# Altium schematic sheet Sheet2.SchDoc
size A3
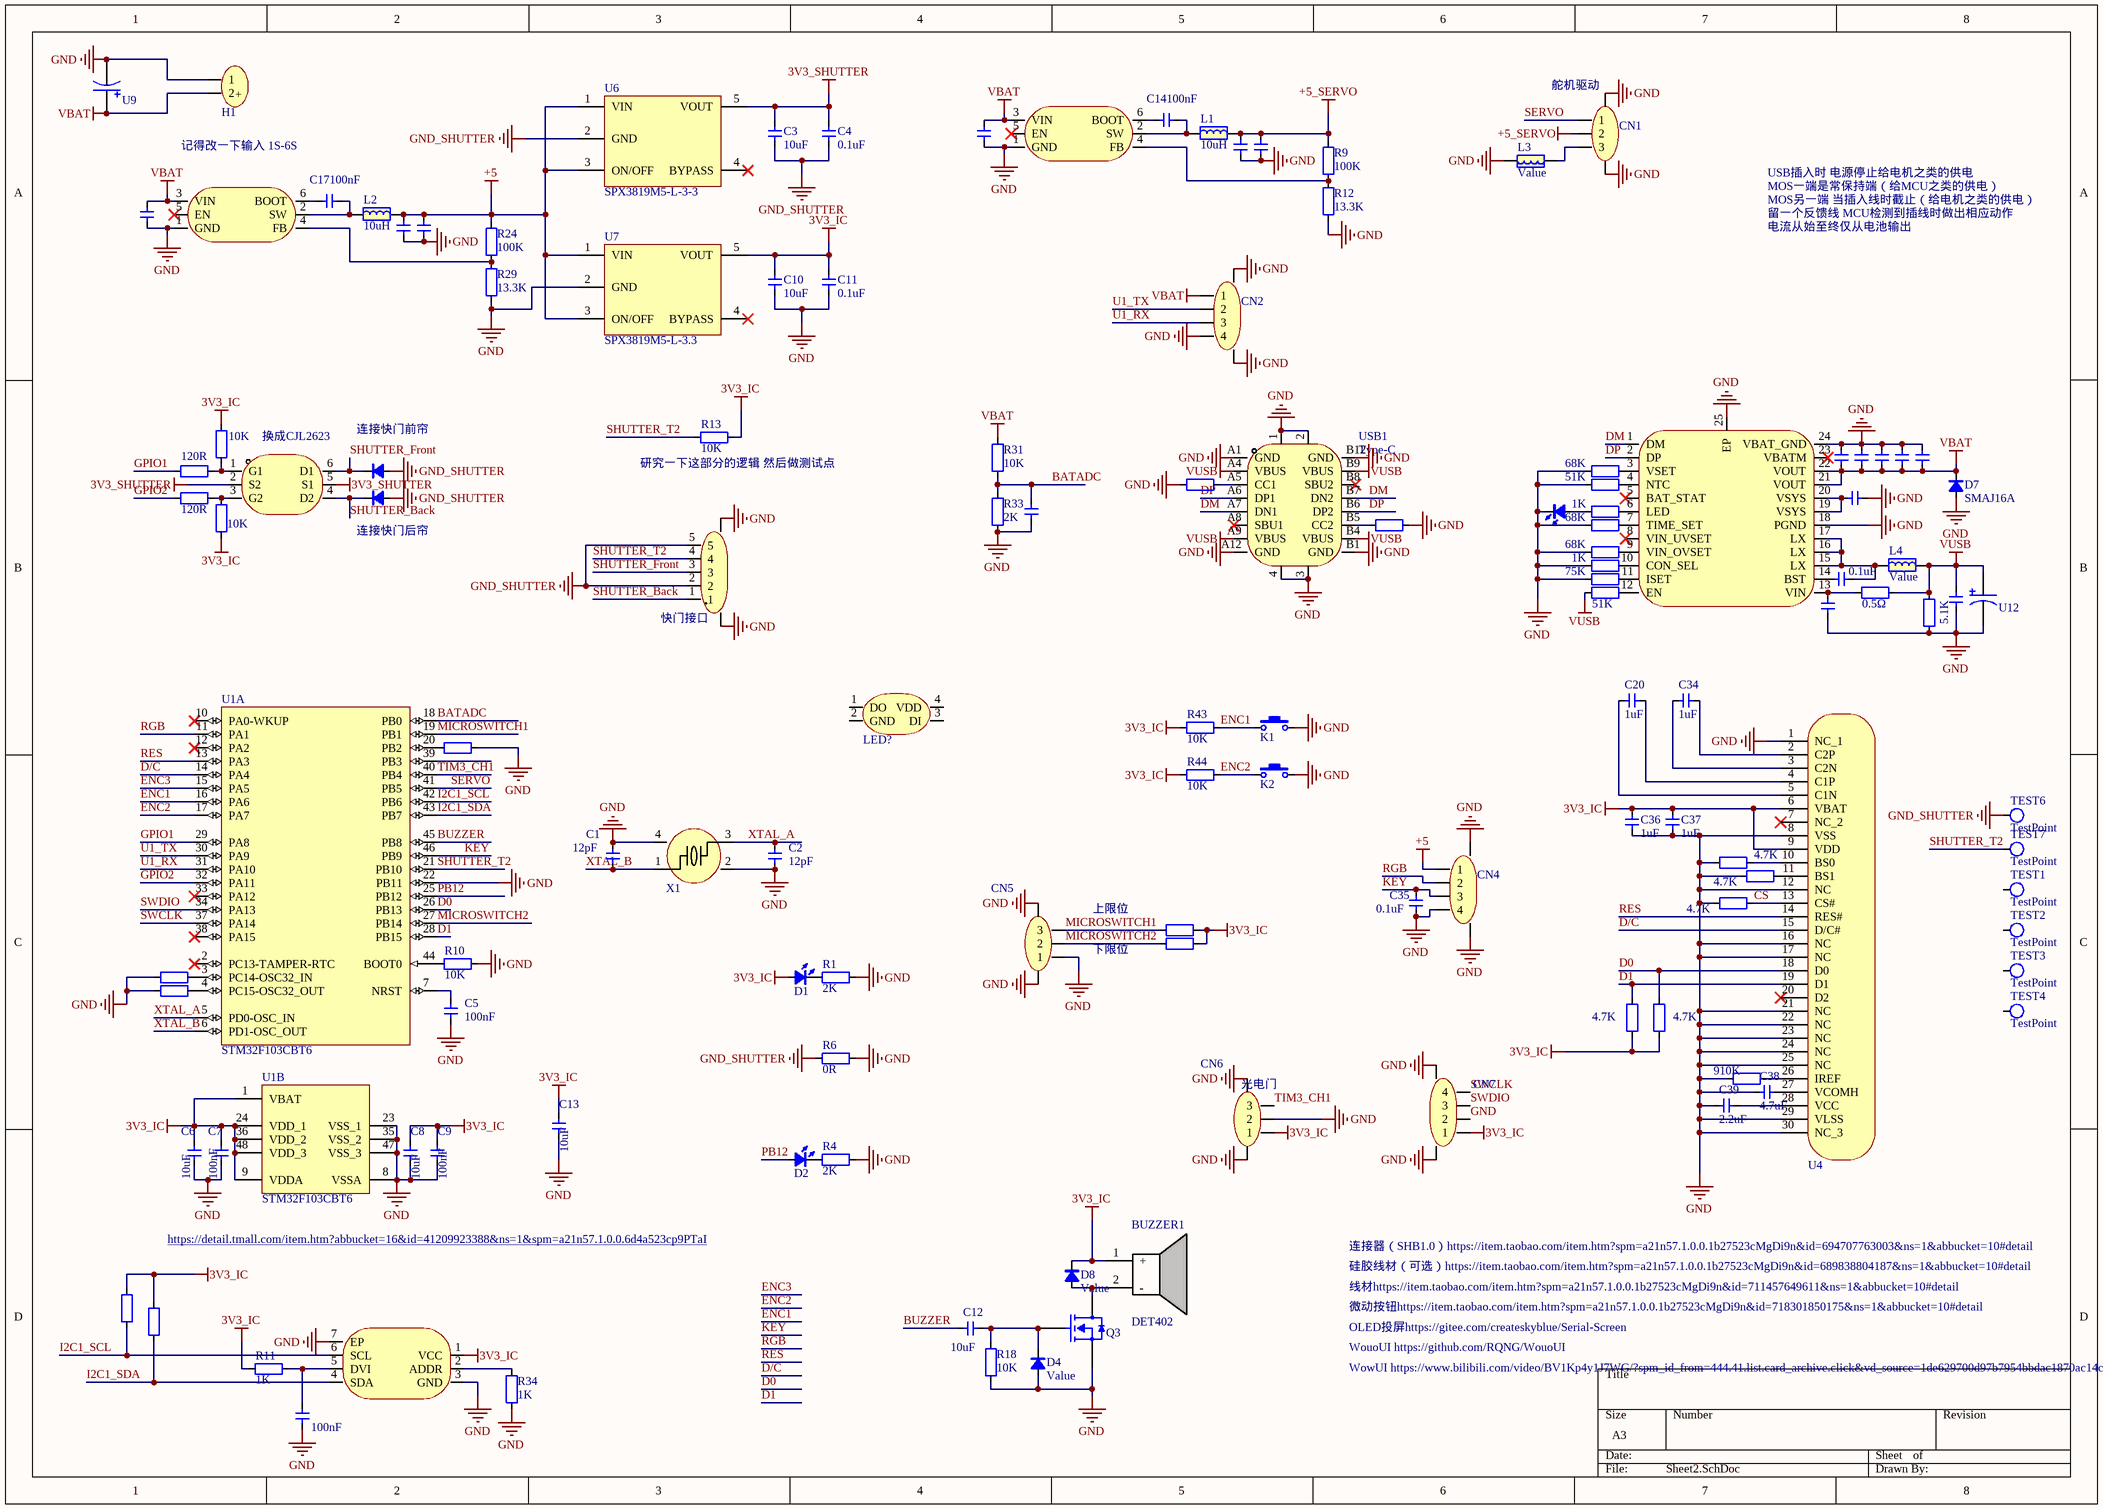
[diagram p0: Sheet2.SchDoc]

## Parts
BUZZER1  DET402  [BUZ-SMD_L4.0-W4.0-P3.50-L]
C1  12pF  [CAP_0402]
C2  12pF  [CAP_0402]
C3  10uF  [CAP_0402]
C4  0.1uF  [CAP_0402]
C5  100nF  [CAP_0402]
C6  10uF  [CAP_0402]
C7  100nF  [CAP_0402]
C8  10uF  [CAP_0402]
C9  100nF  [CAP_0402]
C10  10uF  [CAP_0402]
C11  0.1uF  [CAP_0402]
C12  10uF  [CAP_0402]
C13  10uF  [CAP_0402]
C14  100nF  [CAP_0402]
C15  10uF  [CAP_0805]  (value not drawn)
C16  10uF  [CAP_0805]  (value not drawn)
C17  100nF  [CAP_0402]
C18  100nF  [CAP_0402]  (value not drawn)
C19  100nF  [CAP_0402]
C20  1uF  [CAP_0402]
C21  100nF  [CAP_0402]  (value not drawn)
C22  100nF  [CAP_0603]  (value not drawn)
C23  100nF  [CAP_0603]  (value not drawn)
C24  100nF  [CAP_0402]  (value not drawn)
C25  100nF  [CAP_0402]  (value not drawn)
C26  100nF  [CAP_0402]  (value not drawn)
C27  10uF  [CAP_0805]  (value not drawn)
C28  10uF  [CAP_0805]  (value not drawn)
C29  10uF  [CAP_0805]  (value not drawn)
C30  10uF  [CAP_0603]  (value not drawn)
C31  0.1uF  [CAP_0402]
C32  10uF  [CAP_0805]  (value not drawn)
C33  10uF  [CAP_0603]  (value not drawn)
C34  1uF  [CAP_0402]
C35  0.1uF  [CAP_0402]
C36  1uF  [CAP_0402]
C37  1uF  [CAP_0402]
C38  4.7uF  [CAP_0402]
C39  2.2uF  [CAP_0402]
CN1  HDGC1002WR-S-3P  [SH1.0_3P-STAND]  (value not drawn)
CN2  HDGC1002WR-S-4P  [SH1.0_4P-STAND]  (value not drawn)
CN3  5P端子  [SH1.0-5P-STAND]  (value not drawn)
CN4  HDGC1002WR-S-4P  [SH1.0_4P-STAND]  (value not drawn)
CN5  HDGC1002WR-S-3P  [SH1.0_3P-STAND]  (value not drawn)
CN6  HDGC1002WR-S-3P  [SH1.0_3P-STAND]  (value not drawn)
CN7  HDGC1002WR-S-4P  [SH1.0_4P-STAND]  (value not drawn)
D1  color?  [LED_0805]  (value not drawn)
D2  color?  [LED_0805]  (value not drawn)
D3  lue  [SOD_323]  (value not drawn)
D4  Value  [SOD-523_L1.2-W0.8-LS1.6-RD]
D5  lue  [SOD_323]  (value not drawn)
D6  color?  [LED_0402]  (value not drawn)
D7  SMAJ16A  [SMA]
D8  Value  [SOD-523_L1.2-W0.8-LS1.6-RD]
H1  XT30U_M  [XT30U_M_Null]  (value not drawn)
K1  TACT 2P  [Kailh_MicroSwitch]  (value not drawn)
K2  TACT 2P  [Kailh_MicroSwitch]  (value not drawn)
L1  10uH  [IND-SMD_L4.0-W4.0]
L2  10uH  [IND-SMD_L4.0-W4.0]
L3  Value  [IND_0805]
L4  Value  [IND-SMD_L4.0-W4.0]
LED?  WS2812B-2020  [LED-SMD_4P-L2.0-W2.0-TL_WS2812B-2020]  (value not drawn)
Q1  CJL2623  [SOT-23-6_L2.9-W1.6-P0.95-LS2.8-BR]  (value not drawn)
Q3  Value  [SOT23_3]  (value not drawn)
R1  2K  [RES_0402]
R2  10K  [RES_0402]
R3  120R  [RES_0402]
R4  2K  [RES_0402]
R5  10K  [RES_0402]  (value not drawn)
R6  0R  [RES_0402]
R7  120R  [RES_0402]
R8  10K  [RES_0402]
R9  100K  [RES_0402]
R10  10K  [RES_0402]
R11  1K  [RES_0402]
R12  13.3K  [RES_0402]
R13  10K  [RES_0402]
R14  4.7K  [RES_0402]  (value not drawn)
R15  4.7K  [RES_0402]  (value not drawn)
R16  10K  [RES_0402]  (value not drawn)
R17  10K  [RES_0402]  (value not drawn)
R18  10K  [RES_0402]
R19  68K  [RES_0402]
R20  5.1K  [RES_0402]  (value not drawn)
R21  1K  [RES_0402]
R22  5.1K  [RES_0402]  (value not drawn)
R23  68K  [RES_0402]
R24  100K  [RES_0402]
R25  68K  [RES_0402]
R26  75K  [RES_0402]
R27  51K  [RES_0402]
R28  0.5Ω  [RES_0805]
R29  13.3K  [RES_0402]
R30  5.1K  [RES_0402]
R31  10K  [RES_0402]
R32  51K  [RES_0402]
R33  2K  [RES_0402]
R34  1K  [RES_0402]
R35  4.7K  [RES_0402]
R36  10K  [RES_0402]  (value not drawn)
R37  10K  [RES_0402]  (value not drawn)
R38  4.7K  [RES_0402]
R39  4.7K  [RES_0402]
R40  4.7K  [RES_0402]
R41  4.7K  [RES_0402]
R42  910K  [RES_0402]
R43  10K  [RES_0402]
R44  10K  [RES_0402]
R45  1K  [RES_0402]
TEST1  TestPoint  [TestPoint_0402]
TEST2  TestPoint  [TestPoint_0402]
TEST3  TestPoint  [TestPoint_0402]
TEST4  TestPoint  [TestPoint_0402]
TEST6  TestPoint  [TestPoint_0402]
TEST7  TestPoint  [TestPoint_0402]
U1  STM32F103CBT6  [LQFP_48]  (parts A,B of 2)
U2  TPS54202DDCR  [SOT-23-6_L2.9-W1.6-P0.95-LS2.8-BR]  (value not drawn)
U3  TPS54202DDCR  [SOT-23-6_L2.9-W1.6-P0.95-LS2.8-BR]  (value not drawn)
U4  SSD1306/15  [OLED_0.96_30P]  (value not drawn)
U5  IP2326  [VQFN-24_L4.0-W4.0-P0.50-BL-EP2.5]  (value not drawn)
U6  SPX3819M5-L-3-3  [SOT23_5]
U7  SPX3819M5-L-3.3  [SOT23_5]
U8  BH1750FVI-TR  [WSOF-6_L2.6-W1.6-P0.50-TL-EP]  (value not drawn)
U9  TE-D  [CAP-SMD_BD5.0-L5.3-W5.3-LS6.3-FD]  (value not drawn)
U12  TE-D  [CAP-SMD_BD5.0-L5.3-W5.3-LS6.3-FD]  (value not drawn)
USB1  Type-C  [TYPE-C_16P]
X1  XYDBPCNANF-12MHZ  [CARSTAL_4P_2520]  (value not drawn)

## Nets
3V3_IC: BUZZER1.1(+) C6.2 C7.2 C8.2 C9.2 C10.2 C11.2 C13.2 C36.1 C37.1 CN6.1 CN7.1 D1.1(A) D8.1(K) R2.2 R8.1 R11.1 R13.2 R14.2 R15.1 R36.1 R37.1 R40.2 R41.2 R43.2 R44.2 U1.1(VBAT) U1.9(VDDA) U1.24(VDD_1) U1.36(VDD_2) U1.48(VDD_3) U4.6(VBAT) U4.9(VDD) U7.5(VOUT) U8.1(VCC)
3V3_SHUTTER: C3.2 C4.2 Q1.2(S2) Q1.5(S1) U6.5(VOUT)
+5: C22.1 C23.1 CN4.1 L2.2 R24.2 U6.1(VIN) U6.3(ON/OFF) U7.1(VIN) U7.3(ON/OFF)
+5_SERVO: C24.1 C26.1 CN1.2 L1.2 R9.2
GND: C1.2 C2.1 C5.1 C6.1 C7.1 C8.1 C9.1 C10.1 C11.1 C13.1 C15.2 C16.2 C18.1 C19.1 C21.1 C22.2 C23.2 C24.2 C25.1 C26.2 C27.2 C28.2 C29.2 C30.1 C32.1 C33.1 C35.1 C36.2 C37.2 C38.1 C39.1 CN1.4 CN1.5 CN2.4 CN2.5 CN2.6 CN3.6 CN3.7 CN4.4 CN4.5 CN4.6 CN5.1 CN5.4 CN5.5 CN6.2 CN6.4 CN6.5 CN7.2 CN7.5 CN7.6 D4.2(A) D6.2(K) D7.2(A) H1.1 K1.2 K2.2 L3.2 Q3.2(S) R1.1 R4.1 R5.1 R6.2 R10.1 R12.1 R16.2 R17.2 R18.2 R19.1 R20.1 R22.2 R23.1 R25.1 R26.1 R29.1 R30.1 R32.1 R33.1 R34.2 R35.1 R38.1 R39.1 R42.2 R45.1 U1.8(VSSA) U1.22(PB11) U1.23(VSS_1) U1.35(VSS_2) U1.47(VSS_3) U2.1(GND) U3.1(GND) U4.1(NC_1) U4.8(VSS) U4.12(NC) U4.16(NC) U4.17(NC) U4.21(NC) U4.22(NC) U4.23(NC) U4.24(NC) U4.25(NC) U4.29(VLSS) U4.30(NC_3) U5.18(PGND) U5.24(VBAT_GND) U5.25(EP) U7.2(GND) U8.3(GND) U8.7(EP) U9.2 U12.2 USB1.1 USB1.2 USB1.3 USB1.4 USB1.A1(GND) USB1.A12(GND) USB1.B1(GND) USB1.B12(GND) X1.2(GND) X1.4(GND)
GND_SHUTTER: C3.1 C4.1 CN3.2 CN3.5 D3.1(A) D5.1(A) R6.1 TEST6.1 U6.2(GND)
VBAT: C15.1 C16.1 C18.2 C21.2 C27.1 C28.1 C29.1 CN2.1 D7.1(K) H1.2 R31.2 U2.3(VIN) U3.3(VIN) U5.21(VOUT) U5.22(VOUT) U9.1
VUSB: C32.2 L4.2 R27.2 R28.2 R30.2 U12.1 USB1.A4(VBUS) USB1.A9(VBUS) USB1.B4(VBUS) USB1.B9(VBUS)
BATADC: C25.2 R31.1 R33.2 U1.18(PB0)
BUZZER: C12.2 U1.45(PB8)
CS: R39.2 U4.13(CS#)
D0: R41.1 U1.26(PB13) U4.18(D0)
D1: R40.1 U1.28(PB15) U4.19(D1)
D/C: U1.14(PA4) U4.15(D/C#)
DM: U5.1(DM) USB1.A7(DN1) USB1.B7(DN2)
DP: U5.2(DP) USB1.A6(DP1) USB1.B6(DP2)
ENC1: K1.1 R43.1 U1.16(PA6)
ENC2: K2.1 R44.1 U1.17(PA7)
ENC3: U1.15(PA5)
GPIO1: R3.2 U1.29(PA8)
GPIO2: R7.2 U1.32(PA11)
I2C1_SCL: R14.1 U1.42(PB6) U8.6(SCL)
I2C1_SDA: R15.2 U1.43(PB7) U8.4(SDA)
KEY: C35.2 CN4.3 U1.46(PB9)
MICROSWITCH1: CN5.3 R36.2 U1.19(PB1)
MICROSWITCH2: CN5.2 R37.2 U1.27(PB14)
PB12: D2.1(A) U1.25(PB12)
RES: U1.13(PA3) U4.14(RES#)
RGB: CN4.2 U1.11(PA1)
SERVO: CN1.1 U1.41(PB5)
SHUTTER_Back: CN3.1 D5.2(K) Q1.4(D2)
SHUTTER_Front: CN3.3 D3.2(K) Q1.6(D1)
SHUTTER_T2: CN3.4 R13.1 TEST7.1 U1.21(PB10)
SWCLK: CN7.4 U1.37(PA14)
SWDIO: CN7.3 U1.34(PA13)
TIM3_CH1: CN6.3 U1.40(PB4)
U1_RX: CN2.3 U1.31(PA10)
U1_TX: CN2.2 U1.30(PA9)
XTAL_A: C2.2 U1.5(PD0-OSC_IN) X1.3
XTAL_B: C1.1 U1.6(PD1-OSC_OUT) X1.1
NetBUZZER1_2: BUZZER1.2(-) D8.2(A) Q3.3(D)
NetC5_2: C5.2 U1.7(NRST)
NetC12_1: C12.1 D4.1(K) Q3.1(G) R18.1
NetC14_1: C14.1 L1.1 U3.2(SW)
NetC14_2: C14.2 U3.6(BOOT)
NetC17_1: C17.1 L2.1 U2.2(SW)
NetC17_2: C17.2 U2.6(BOOT)
NetC19_2: C19.2 R11.2 U8.5(DVI)
NetC20_1: C20.1 U4.4(C1P)
NetC20_2: C20.2 U4.5(C1N)
NetC30_2: C30.2 U5.19(VSYS) U5.20(VSYS)
NetC31_1: C31.1 L4.1 U5.15(LX) U5.16(LX) U5.17(LX)
NetC31_2: C31.2 U5.14(BST)
NetC33_2: C33.2 R28.1 U5.13(VIN)
NetC34_1: C34.1 U4.2(C2P)
NetC34_2: C34.2 U4.3(C2N)
NetC38_2: C38.2 U4.27(VCOMH)
NetC39_2: C39.2 U4.28(VCC)
NetCN1_3: CN1.3 L3.1
NetD1_2: D1.2(K) R1.2
NetD2_2: D2.2(K) R4.2
NetD6_1: D6.1(A) R21.1
NetQ1_1: Q1.1(G1) R2.1 R3.1
NetQ1_3: Q1.3(G2) R7.1 R8.2
NetR5_2: R5.2 U1.20(PB2)
NetR9_1: R9.1 R12.2 U3.4(FB)
NetR10_2: R10.2 U1.44(BOOT0)
NetR16_1: R16.1 U1.3(PC14-OSC32_IN)
NetR17_1: R17.1 U1.4(PC15-OSC32_OUT)
NetR19_2: R19.2 U5.3(VSET)
NetR20_2: R20.2 USB1.A5(CC1)
NetR21_2: R21.2 U5.6(LED)
NetR22_1: R22.1 USB1.B5(CC2)
NetR23_2: R23.2 U5.7(TIME_SET)
NetR24_1: R24.1 R29.2 U2.4(FB)
NetR25_2: R25.2 U5.9(VIN_OVSET)
NetR26_2: R26.2 U5.11(ISET)
NetR27_1: R27.1 U5.12(EN)
NetR32_2: R32.2 U5.4(NTC)
NetR34_1: R34.1 U8.2(ADDR)
NetR35_2: R35.2 U4.10(BS0)
NetR38_2: R38.2 U4.11(BS1)
NetR42_1: R42.1 U4.26(IREF)
NetR45_2: R45.2 U5.10(CON_SEL)

Not connected (* = marked no-connect by the designer): LED? 1(DO) 2(GND) 3(DI) 4(VDD); TEST1 1; TEST2 1; TEST3 1; TEST4 1; U1 2(PC13-TAMPER-RTC)* 10(PA0-WKUP)* 12(PA2)* 33(PA12)* 38(PA15)* 39(PB3); U2 5(EN)*; U3 5(EN)*; U4 7(NC_2)* 20(D2)*; U5 5(BAT_STAT)* 8(VIN_UVSET)* 23(VBATM)*; U6 4(BYPASS)*; U7 4(BYPASS)*; USB1 A8(SBU1)* B8(SBU2)*

## Notes on the sheet
- (near CN1) 舵机驱动
- 记得改一下输入 1S-6S
- USB插入时 电源停止给电机之类的供电
- MOS一端是常保持端（给MCU之类的供电）
- MOS另一端 当插入线时截止（给电机之类的供电）
- 留一个反馈线 MCU检测到插线时做出相应动作
- 电流从始至终仅从电池输出
- 换成CJL2623
- 连接快门前帘
- (near R13) 研究一下这部分的逻辑 然后做测试点
- 连接快门后帘
- (near CN3) 快门接口
- 上限位
- 下限位
- (near CN6) 光电门
- https://detail.tmall.com/item.htm?abbucket=16&id=41209923388&ns=1&spm=a21n57.1.0.0.6d4a523cp9PTaI
- 连接器（SHB1.0）https://item.taobao.com/item.htm?spm=a21n57.1.0.0.1b27523cMgDi9n&id=694707763003&ns=1&abbucket=10#detail
- 微动按钮https://item.taobao.com/item.htm?spm=a21n57.1.0.0.1b27523cMgDi9n&id=718301850175&ns=1&abbucket=10#detail
- 线材https://item.taobao.com/item.htm?spm=a21n57.1.0.0.1b27523cMgDi9n&id=711457649611&ns=1&abbucket=10#detail
- 硅胶线材（可选）https://item.taobao.com/item.htm?spm=a21n57.1.0.0.1b27523cMgDi9n&id=689838804187&ns=1&abbucket=10#detail
- OLED投屏https://gitee.com/createskyblue/Serial-Screen
- WouoUI https://github.com/RQNG/WouoUI
- WowUI https://www.bilibili.com/video/BV1Kp4y1J7WG/?spm_id_from=444.41.list.card_archive.click&vd_source=1de629700d97b7954bbdac1870ac14c1
- (in symbol XT30U_M) +

## Library data of the parts
C1-C39 = Capacitor_MLCC
CN1 CN5 CN6 = 3P端子: Manufacturer: HDGC(华德共创); Add into BOM: yes; Name: HDGC1002WR-S-3P; Symbol: HDGC1002WR-S-3P; Device: HDGC1002WR-S-3P; LCSC Part Name: SH1.0针座卧贴 3P; Supplier Part: C2936213; Manufacturer Part: HDGC1002WR-S-3P; Supplier Footprint: SMD,P=1mm; JLCPCB Part Class: 扩展库; Datasheet: https://atta.szlcsc.com/upload/public/pdf/source/20211229/E8A09E85670B5E97244D2008A24D97FE.pdf; Supplier: LCSC; Convert to PCB: yes
CN2 CN4 CN7 = 4P端子: Manufacturer: HDGC(华德共创); Add into BOM: yes; Name: HDGC1002WR-S-4P; Symbol: HDGC1002WR-S-4P; Device: HDGC1002WR-S-4P; LCSC Part Name: SH1.0针座卧贴 4P; Supplier Part: C2936214; Manufacturer Part: HDGC1002WR-S-4P; Supplier Footprint: SMD,P=1mm; JLCPCB Part Class: 扩展库; Datasheet: https://atta.szlcsc.com/upload/public/pdf/source/20211229/E8A09E85670B5E97244D2008A24D97FE.pdf; Supplier: LCSC; Convert to PCB: yes
CN3 = 5P端子: Manufacturer: BOOMELE(博穆精密); Name: GH1.25-5PWBPZ; Add into BOM: yes; Symbol: GH1.25-5PWBPZ; Device: GH1.25-5PWBPZ; LCSC Part Name: GH1.25-5P卧贴编带; Supplier Part: C2829254; Manufacturer Part: GH1.25-5PWBPZ; Supplier Footprint: -; JLCPCB Part Class: 扩展库; Datasheet: https://atta.szlcsc.com/upload/public/pdf/source/20211125/08A09A4909F58AF780B71FE423A00F7E.pdf; Supplier: LCSC; Convert to PCB: yes
D1 D2 D6 = LED: Value: color?
D3-D5 D7 D8 = Diode_SMD: Value: color?
H1 = XT30U_M: Manufacturer: AMASS(艾迈斯); Name: XT30U-M; Symbol: DC电源; Pin Type: IN; Add into BOM: yes; Device: XT30U-M; Convert to PCB: yes; Supplier Part: C99101; Supplier: LCSC; Manufacturer Part: XT30U-M; JLCPCB Part Class: 扩展库
K1 K2 = Button_2P: Button; type: TACT 2P
L1-L4 = Inductor_SMD
LED? = WS2812B-2020: 发光颜色:RGB三色;二极管配置:-;透镜颜色:-;主波长:470.4nm；622.5nm；515.6nm;峰值波长:-;色温:-;测试电流:12mA;功率:-;发光角度:-;安装方式:-;工作温度:-;; Manufacturer: worldsemi; Add into BOM: yes; Emitted Color: RGB三色; Forward Current: 12mA; Name: WS2812B-2020; Symbol: WS2812B-2020; Device: WS2812B-2020; LCSC Part Name: RGB三色 470.4nm 515.6nm 622.5nm （注意防潮，请查阅规格书中对应具体内容）; Supplier Part: C965555; Manufacturer Part: WS2812B-2020; Supplier Footprint: SMD,2x2mm; JLCPCB Part Class: 扩展库; Datasheet: https://atta.szlcsc.com/upload/public/pdf/source/20201203/C965555_5C919C4B6231E6ADE06011FB0D94282B.pdf; Supplier: LCSC; Convert to PCB: yes; Diode Configuration: -; Lens Color: -; Dominant Wavelength: 470.4nm；622.5nm；515.6nm; Peak Wavelength: -; Color Temperature: -; Power Dissipation: -; Viewing Angle: -; Mounting Sytle: -; Operating Temperature: -
Q1 = CJL2623: Manufacturer: CJ(江苏长电/长晶); Add into BOM: yes; Type: P沟道; Drain Source Voltage (Vdss): -30V; Continuous Drain Current (Id): -3A; Power Dissipation (Pd): 350mW; Drain Source On Resistance (RDS(on)@Vgs,Id): 130mΩ@10V,3A; Gate Threshold Voltage (Vgs(th)@Id): 20V; Total Gate Charge (Qg@Vgs): 4.5nC; Input Capacitance (Ciss@Vds): 240pF; Reverse Transfer Capacitance (Crss@Vds): 32pF; Name: CJL2623; Symbol: CJL2623; Device: CJL2623; LCSC Part Name: P沟道 耐压:-30V 电流:-3A; Supplier Part: C139831; Manufacturer Part: CJL2623; Supplier Footprint: SOT-23-6; JLCPCB Part Class: Extended Part; Datasheet: https://atta.szlcsc.com/upload/public/pdf/source/20171129/C139831_15119539744621151327.pdf; Supplier: LCSC; Convert to PCB: yes
Q3 = MOSFET_N: N_MOS
R1-R45 = Resistor_SMD: Value: 22R
U1 = STM32F103CBT6: ARM Cortex-M3 32-bit MCU, 128 KB Flash, 20 KB Internal RAM, 37 I/Os, 48-pin LQFP, -40 to 85 degC, Tray; A/D Converter: 2x12-bit (10 Channel); FLASH Size (Prog) (kB): 128; I/Os (High Current): 37; Internal RAM Size (kB): 20; Operating Frequency(F) (Processor speed) (MHz): 72; Supply Voltage(Vcc) min (V): 2; DatasheetVersion: Rev. 16; PackageVersion: Rev. 6, 06/2013; PackageReference: LQFP48; PackageDescription: 48-Pin Low Profile Quad Flat Package, 7 x 7 mm Body, 0.5 mm Pitch; Supplier 1: Digi-Key; Supplier Part Number 1: 497-6288-ND; Supplier 2: Farnell; Supplier Part Number 2: 1606327; Supplier 3: Newark; Supplier Part Number 3: 11N8296; Supplier 4: Newark; Supplier Part Number 4: 57P1214; Supplier 5: Mouser; Supplier Part Number 5: 511-STM32F103CBT6; Core: ARM Cortex-M3; Packing: Tray; Mounting Technology: Surface Mount; PartNumber: STM32F103CBT6; ComponentLink1Description: Manufacturer URL; ComponentLink1URL: http://www.st.com/web/en/home.html; ComponentLink2Description: Datasheet; ComponentLink2URL: http://www.st.com/st-web-ui/static/active/en/resource/technical/document/datasheet/CD00161566.pdf; ComponentLink3Description: Package Specification; ComponentLink3URL: http://www.st.com/st-web-ui/static/active/en/resource/technical/document/datasheet/DM00058181.pdf
U2 U3 = TPS54202DDCR: Manufacturer: TI(德州仪器); Add into BOM: yes; Name: TPS54202DDCR; Symbol: TPS54202DDCR; Device: TPS54202DDCR; LCSC Part Name: TPS54202DDCR; Supplier Part: C191884; Manufacturer Part: TPS54202DDCR; Supplier Footprint: SOT-23-6; JLCPCB Part Class: Extended Part; Datasheet: https://atta.szlcsc.com/upload/public/pdf/source/20181012/C191884_C6DBFD980275651BD8C8F427C2E48058.pdf; Supplier: LCSC; Convert to PCB: yes
U4 = SSD1306-12864: Convert to PCB: yes; Symbol: SSD1306/15; Device: SSD1306/15; Add into BOM: yes
U5 = IP2326: Manufacturer: INJOINIC(英集芯); Add into BOM: yes; Name: IP2326; Symbol: IP2326; Device: IP2326; LCSC Part Name: IP2326; Supplier Part: C2832094; Manufacturer Part: IP2326; Supplier Footprint: VQFN-24-EP(4x4); JLCPCB Part Class: Extended Part; Datasheet: https://atta.szlcsc.com/upload/public/pdf/source/20210701/C2832094_E17C44C11E64EBC07E8B83E7E48DDEF6.pdf; Supplier: LCSC; Convert to PCB: yes
U6 U7 = LP2992: LP2992_LDO
U8 = BH1750FVI-TR: Manufacturer: ROHM(罗姆); Add into BOM: yes; Name: BH1750FVI-TR; Symbol: BH1750FVI-TR; Device: BH1750FVI-TR; LCSC Part Name: BH1750FVI-TR; Supplier Part: C78960; Manufacturer Part: BH1750FVI-TR; Supplier Footprint: WSOF-6; JLCPCB Part Class: Extended Part; Datasheet: https://atta.szlcsc.com/upload/public/pdf/source/20160723/1469258984787.pdf; Supplier: LCSC; Convert to PCB: yes
U9 U12 = Capacitor_有极: Add into BOM: yes; Name: TE-D; Symbol: TE-D; Device: TE-D; LCSC Part Name: TE-D; Supplier Part: C9900024669; Manufacturer Part: TE-D; Supplier Footprint: 钽电容7343; JLCPCB Part Class: 扩展库; Datasheet: https://atta.szlcsc.comnull; Supplier: LCSC; Convert to PCB: yes
USB1 = USB-Type-C: USB-Type-C_16P
X1 = Crystal_4P: 四脚无源晶振; Manufacturer: TAITIEN(泰艺电子); Add into BOM: yes; Name: -; Symbol: XYDBPCNANF-12MHZ; Device: XYDBPCNANF-12MHZ; Convert to PCB: yes; LCSC Part Name: 12MHz 12pF ±10ppm -20~+70℃; Supplier Part: C521567; Manufacturer Part: XYDBPCNANF-12MHZ; Supplier Footprint: SMD2520-4P; JLCPCB Part Class: 扩展库; Datasheet: https://atta.szlcsc.com/upload/public/pdf/source/20200427/C521567_8D8DDB0F2E066B5BAD7A5878EBE465E2.pdf; Supplier: LCSC; Crystal Type: -; Value: -; Frequency Tolerance: -; Frequency Stability: -; Load Capacitance: -; Operating Temperature: -